# Altium schematic sheet INTERFACE.SchDoc
size 320 x 228 mm; DocumentNumber: 3; SheetNumber: 3; SheetTotal: 5
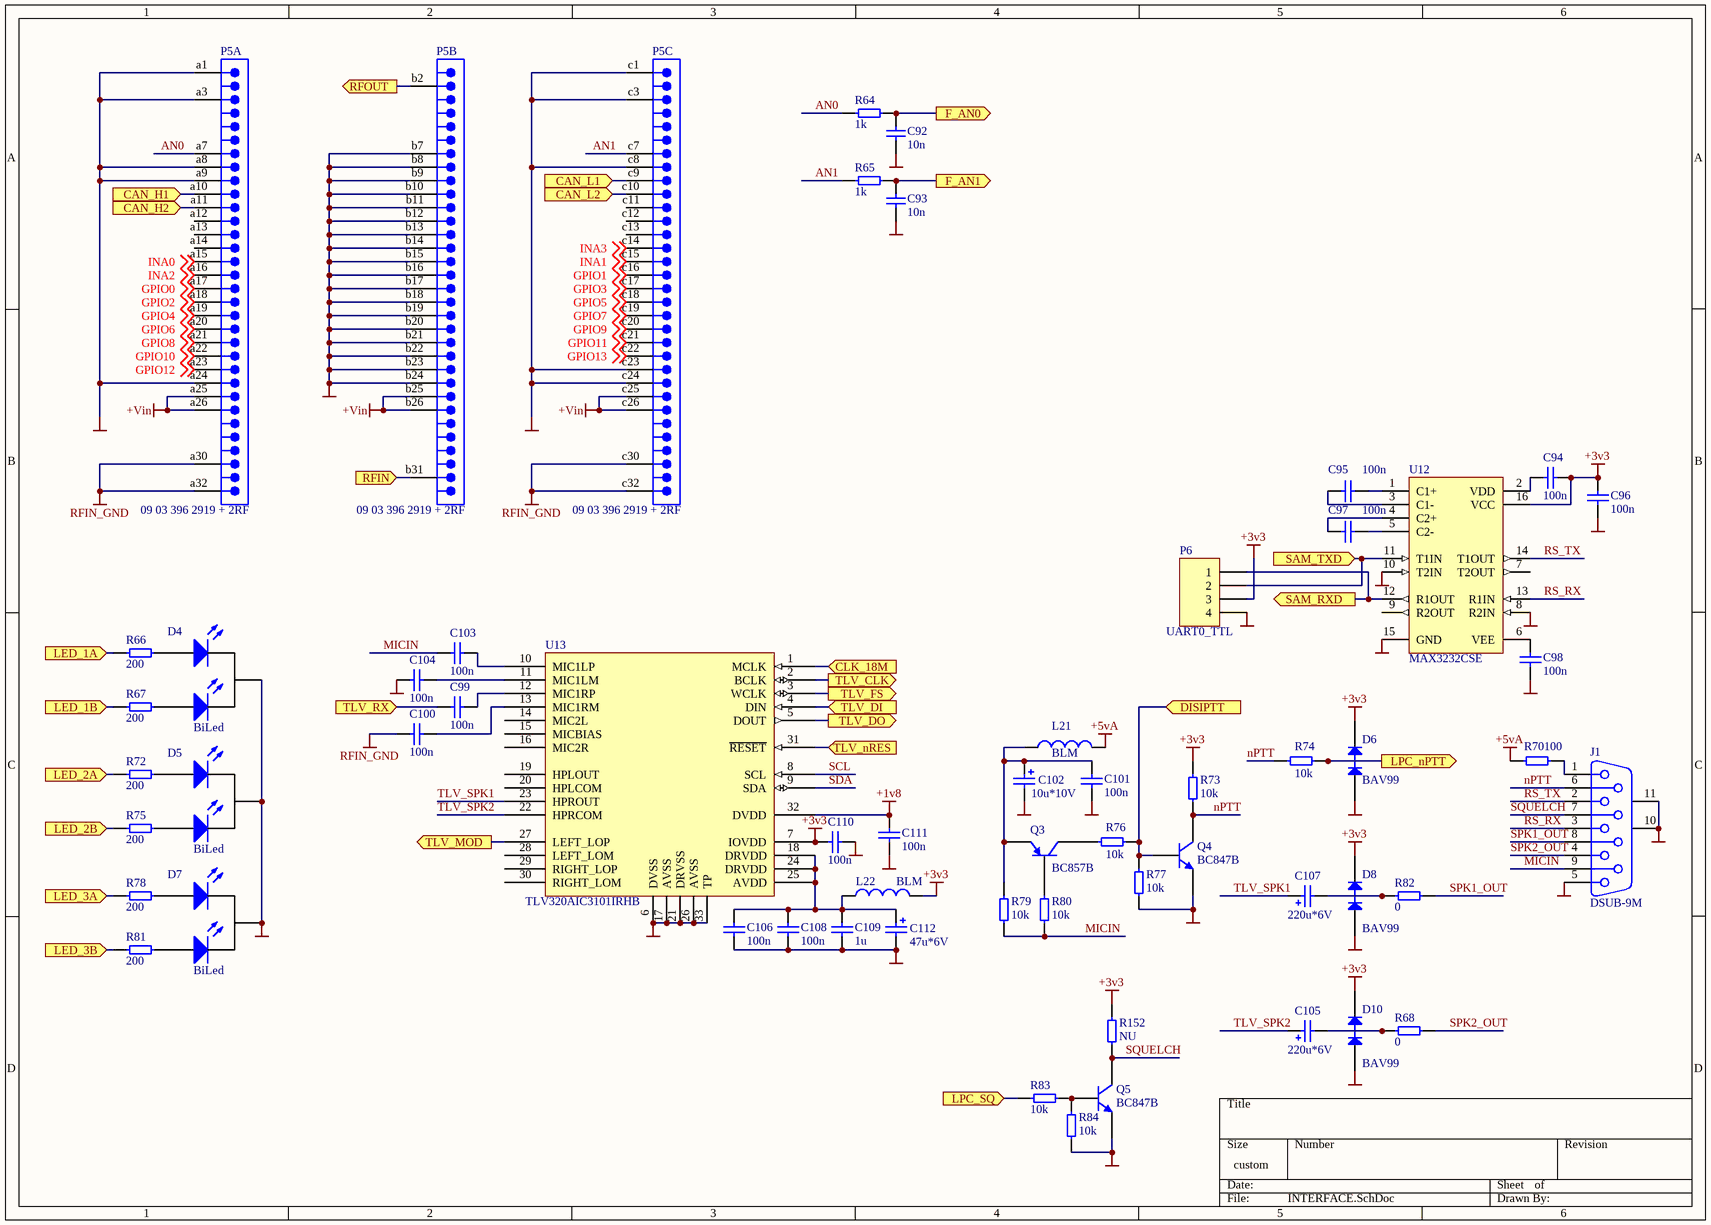
[diagram p0: INTERFACE.SchDoc]

## Parts
C92  10n  [CAPC1608L]
C93  10n  [CAPC1608L]
C94  100n  [CAPC1608N]
C95  100n  [CAPC1608N]
C96  100n  [CAPC1608N]
C97  100n  [CAPC1608N]
C98  100n  [CAPC1608N]
C99  100n  [CAPC1608N]
C100  100n  [CAPC1608N]
C101  100n  [CAPC1608N]
C102  10u*10V  [Case_A]
C103  100n  [CAPC1608N]
C104  100n  [CAPC1608N]
C105  220u*6V  [Case_C]
C106  100n  [CAPC1608N]
C107  220u*6V  [Case_C]
C108  100n  [CAPC1608N]
C109  1u  [CAPC2012N]
C110  100n  [CAPC1608N]
C111  100n  [CAPC1608N]
C112  47u*6V  [Case_A]
D4  BiLed  [BLED-1]
D5  BiLed  [BLED-1]
D6  BAV99  [SOT-23]
D7  BiLed  [BLED-1]
D8  BAV99  [SOT-23]
D10  BAV99  [SOT-23]
J1  DSUB-9M  [DSUB1.385-2H9]
L21  BLM  [INDC2012L]
L22  BLM  [INDC2012L]
P5  09 03 396 2919 + 2RF  [0903396x919]  (parts A,B,C of 4)
P6  UART0_TTL  [HDR1X4]
Q3  BC857B  [SOT23_N]
Q4  BC847B  [SOT23_N]
Q5  BC847B  [SOT23_N]
R64  1k  [RESC1608L]
R65  1k  [RESC1608L]
R66  200  [RESC1608L]
R67  200  [RESC1608L]
R68  0  [RESC2012L]
R70  100  [RESC2012L]
R72  200  [RESC1608L]
R73  10k  [RESC1608L]
R74  10k  [RESC1608L]
R75  200  [RESC1608L]
R76  10k  [RESC1608L]
R77  10k  [RESC1608L]
R78  200  [RESC1608L]
R79  10k  [RESC1608L]
R80  10k  [RESC1608L]
R81  200  [RESC1608L]
R82  0  [RESC2012L]
R83  10k  [RESC1608L]
R84  10k  [RESC1608L]
R152  NU  [RESC1608L]
U12  MAX3232CSE  [NSO16_N]
U13  TLV320AIC3101IRHB  [QFN50P500X500-32W6N]

## Ports
CAN_H1 (in), CAN_H2 (in), CAN_L1 (in), CAN_L2 (in), CLK_18M (in), DISIPTT (in), F_AN0 (out), F_AN1 (out), LED_1A (in), LED_1B (in), LED_2A (in), LED_2B (in), LED_3A (in), LED_3B (in), LPC_nPTT (out), LPC_SQ (in), RFIN (in), RFOUT (out), SAM_RXD (out), SAM_TXD (in), TLV_CLK (out), TLV_DI (in), TLV_DO (out), TLV_FS (out), TLV_MOD (out), TLV_nRES (in), TLV_RX (in)

## Nets
+1v8: C111.2 U13.32(DVDD)
+3v3: C94.1 C96.2 C110.2 D6.2(K) D8.2(K) D10.2(K) L22.1 P6.3 R73.2 R152.2 U12.16(VCC) U13.7(IOVDD)
+5vA: L21.2 R70.1
+Vin: P5.a25 P5.a26 P5.b25 P5.b26 P5.c25 P5.c26
GND: C92.1 C93.1 C96.1 C98.1 C101.2 C102.2 C104.2 C106.1 C108.1 C109.1 C110.1 C111.1 C112.2 D4.2 D5.2 D6.1(A) D7.2 D8.1(A) D10.1(A) J1.5 J1.10(MH1) J1.11(MH2) P5.a1 P5.a3 P5.a8 P5.a9 P5.a24 P5.b7 P5.b8 P5.b9 P5.b10 P5.b11 P5.b12 P5.b13 P5.b14 P5.b15 P5.b16 P5.b17 P5.b18 P5.b19 P5.b20 P5.b21 P5.b22 P5.b23 P5.b24 P5.c1 P5.c3 P5.c8 P5.c23 P5.c24 P6.4 Q4.2(E) Q5.2(E) R77.1 R84.2 U12.8(R2IN) U12.10(T2IN) U12.15(GND) U13.6(DVSS) U13.17(AVSS) U13.21(DRVSS) U13.26(AVSS) U13.33(TP)
RFIN_GND: C100.2 P5.a30 P5.a32 P5.c30 P5.c32
AN0: P5.a7 R64.1
AN1: P5.c7 R65.1
CAN_H1: P5.a10 ; port CAN_H1
CAN_H2: P5.a11 ; port CAN_H2
CAN_L1: P5.c9 ; port CAN_L1
CAN_L2: P5.c10 ; port CAN_L2
CLK_18M: U13.1(MCLK) ; port CLK_18M
DISIPTT: Q4.1(B) R76.1 R77.2 ; port DISIPTT
F_AN0: C92.2 R64.2 ; port F_AN0
F_AN1: C93.2 R65.2 ; port F_AN1
GPIO0: P5.a17 ; off-sheet GPIO0
GPIO1: P5.c16 ; off-sheet GPIO1
GPIO2: P5.a18 ; off-sheet GPIO2
GPIO3: P5.c17 ; off-sheet GPIO3
GPIO4: P5.a19 ; off-sheet GPIO4
GPIO5: P5.c18 ; off-sheet GPIO5
GPIO6: P5.a20 ; off-sheet GPIO6
GPIO7: P5.c19 ; off-sheet GPIO7
GPIO8: P5.a21 ; off-sheet GPIO8
GPIO9: P5.c20 ; off-sheet GPIO9
GPIO10: P5.a22 ; off-sheet GPIO10
GPIO11: P5.c21 ; off-sheet GPIO11
GPIO12: P5.a23 ; off-sheet GPIO12
GPIO13: P5.c22 ; off-sheet GPIO13
INA0: P5.a15 ; off-sheet INA0
INA1: P5.c15 ; off-sheet INA1
INA2: P5.a16 ; off-sheet INA2
INA3: P5.c14 ; off-sheet INA3
LED_1A: R66.2 ; port LED_1A
LED_1B: R67.2 ; port LED_1B
LED_2A: R72.2 ; port LED_2A
LED_2B: R75.2 ; port LED_2B
LED_3A: R78.2 ; port LED_3A
LED_3B: R81.2 ; port LED_3B
LPC_nPTT: D6.3(C) R74.1 ; port LPC_nPTT
LPC_SQ: R83.1 ; port LPC_SQ
MICIN: C103.1 J1.9 R79.1 R80.1
nPTT: J1.6 Q4.3(C) R73.1 R74.2
RFIN: P5.b31 ; port RFIN
RFOUT: P5.b2 ; port RFOUT
RS_RX: J1.3 U12.13(R1IN)
RS_TX: J1.2 U12.14(T1OUT)
SAM_RXD: P6.1 U12.12(R1OUT) ; port SAM_RXD
SAM_TXD: P6.2 U12.11(T1IN) ; port SAM_TXD
SCL: U13.8(SCL)
SDA: U13.9(SDA)
SPK1_OUT: J1.8 R82.2
SPK2_OUT: J1.4 R68.2
SQUELCH: J1.7 Q5.3(C) R152.1
TLV_CLK: U13.2(BCLK) ; port TLV_CLK
TLV_DI: U13.4(DIN) ; port TLV_DI
TLV_DO: U13.5(DOUT) ; port TLV_DO
TLV_FS: U13.3(WCLK) ; port TLV_FS
TLV_MOD: U13.27(LEFT_LOP) ; port TLV_MOD
TLV_nRES: U13.31(~{RESET}) ; port TLV_nRES
TLV_RX: C99.1 ; port TLV_RX
TLV_SPK1: C107.1 U13.23(HPROUT)
TLV_SPK2: C105.1 U13.22(HPRCOM)
NetC94_2: C94.2 U12.2(VDD)
NetC95_1: C95.1 U12.3(C1-)
NetC95_2: C95.2 U12.1(C1+)
NetC97_1: C97.1 U12.4(C2+)
NetC97_2: C97.2 U12.5(C2-)
NetC98_2: C98.2 U12.6(VEE)
NetC99_2: C99.2 U13.12(MIC1RP)
NetC100_1: C100.1 U13.13(MIC1RM)
NetC101_1: C101.1 C102.1 L21.1 Q3.2(E) R79.2
NetC103_2: C103.2 U13.10(MIC1LP)
NetC104_1: C104.1 U13.11(MIC1LM)
NetC105_2: C105.2 D10.3(C) R68.1
NetC106_2: C106.2 C108.2 C109.2 C112.1 L22.2 U13.18(DRVDD) U13.24(DRVDD) U13.25(AVDD)
NetC107_2: C107.2 D8.3(C) R82.1
NetD4_1: D4.1 R66.1
NetD4_3: D4.3 R67.1
NetD5_1: D5.1 R72.1
NetD5_3: D5.3 R75.1
NetD7_1: D7.1 R78.1
NetD7_3: D7.3 R81.1
NetJ1_1: J1.1 R70.2
NetQ3_1: Q3.1(B) R80.2
NetQ3_3: Q3.3(C) R76.2
NetQ5_1: Q5.1(B) R83.2 R84.1

Not connected (* = marked no-connect by the designer): P5 a12 a13 a14 c11 c12 c13; U12 7(T2OUT) 9(R2OUT); U13 14(MIC2L) 15(MICBIAS) 16(MIC2R) 19(HPLOUT) 20(HPLCOM) 28(LEFT_LOM) 29(RIGHT_LOP) 30(RIGHT_LOM)

## Library data of the parts
C92-C101 C103 C104 C106 C108-C111 = Cap: Capacitor; Value: 100pF; Published: 8-Jun-2000; LatestRevisionDate: 17-Jul-2002; LatestRevisionNote: Re-released for DXP Platform.; PackageReference: RAD-0.3; Publisher: Altium Limited
C102 C105 C107 C112 = Cap Pol: Polarized Capacitor (Surface Mount); Value: 100pF; Published: 8-Jun-2000; LatestRevisionDate: 17-Jul-2002; LatestRevisionNote: Re-released for DXP Platform.; PackageReference: C0805; Publisher: Altium Limited
D6 D8 D10 = BAV99: Silicon Switching Diode Array for High-Speed Switching; Published: 21-Mar-2003; DatasheetDocument: Oct-1999; PackageDocument: Sep-2001; PackageReference: SOT-23; Publisher: Altium Limited; ComponentLink1Description: Manufacturer Link; ComponentLink1URL: http://www.infineon.com/; ComponentLink2Description: Datasheet; ComponentLink2URL: http://www.infineon.com/upload/Document/cmc_upload/documents/080/631/bav99series_1.pdf
J1 = D Connector 9: Receptacle Assembly, 9 Position, Right Angle; PackageDocument: O; Positions: 9; Published: 15-Jun-2001; LatestRevisionDate: 17-Jul-2002; LatestRevisionNote: Re-released for DXP Platform.; DatasheetDocument: 1-Sep-1999; PackageReference: 788750; Publisher: Altium Limited; Orientation: Right Angle; Gender: Receptacle
L21 L22 = INDUCTOR
P5 = 09 03 396 2919: Eurocard DIN 41612, Type C, 96 Position, Rows a+b+c, Performance level 1, Male, Lead 3.0 mm, Pitch 2.54 mm; DrillSize: Corresponds to nominal value.; Published: 6-Oct-2005; DatasheetDocument: 03-Jun-2003; PackageDocument: 25-Jan-2002; PackageReference: 0903396x919; Publisher: Altium Limited; ComponentLink1Description: Manufacturer Link; ComponentLink1URL: http://www.harting.com/; ComponentLink2Description: Packaging Specification; ComponentLink2URL: http://www.harkis.harting.com/_gds/pdf/TB_0903396x919_BL01_R30797.pdf
P6 = Header 4: Header, 4-Pin; LatestRevisionDate: 17-Jul-2002; LatestRevisionNote: Re-released for DXP Platform.; Publisher: Altium Limited
Q3 = BC857B: PNP General-purpose Transistor; Published: 17-Sep-2003; LatestRevisionDate: 12-Dec-2006; LatestRevisionNote: IPC-7351 Footprint Added.; DatasheetVersion: 4-Feb-2002; PackageVersion: May-1999; PackageReference: SOT23; Publisher: Altium Limited; PackageDescription: 3-Pin SOT-23 Package 0.95 mm Pitch, 2.3 mm Lead Span; ComponentLink1Description: Manufacturer Link; ComponentLink1URL: http://www.semiconductors.philips.com/; ComponentLink2Description: Datasheet; ComponentLink2URL: http://www.semiconductors.philips.com/acrobat/datasheets/BC856_BC857_BC858_6.pdf
Q4 Q5 = BC847B: NPN General-purpose Transistor; Published: 17-Sep-2003; LatestRevisionDate: 12-Dec-2006; LatestRevisionNote: IPC-7351 Footprint Added.; DatasheetVersion: 4-Feb-2002; PackageVersion: May-1999; PackageReference: SOT23; Publisher: Altium Limited; PackageDescription: 3-Pin SOT-23 Package 0.95 mm Pitch, 2.3 mm Lead Span; ComponentLink1Description: Manufacturer Link; ComponentLink1URL: http://www.semiconductors.philips.com/; ComponentLink2Description: Datasheet; ComponentLink2URL: http://www.semiconductors.philips.com/acrobat/datasheets/BC846_BC847_BC848_5.pdf
R64 R65 = Res: Resistor; Published: 8-Jun-2000; LatestRevisionDate: 04-Mar-2005; LatestRevisionNote: PCB Footprint replaced.; PackageReference: J1-0603; Publisher: Altium Limited; Value: 1K
R66-R68 R70 R72-R84 R152 = Res: Resistor; Value: 1K; Published: 8-Jun-2000; LatestRevisionDate: 04-Mar-2005; LatestRevisionNote: PCB Footprint replaced.; PackageReference: J1-0603; Publisher: Altium Limited
U12 = MAX232CSE: +5V Powered, Multi-Channel RS-232 Driver/Receiver; Published: 16-Jan-2001; LatestRevisionDate: 13-Apr-2006; LatestRevisionNote: IPC-7351 Footprint Added.; PackageReference: NSO16; Publisher: Altium Limited; PackageDescription: 16-Pin Small Outline Integrated Circuit 1.27 mm Pitch; Code_JEDEC: MS-012-AC; Code_IPC: SOIC127P600-16; ComponentLink1Description: Manufacturer Link; ComponentLink1URL: http://www.maxim-ic.com/; ComponentLink2Description: Datasheet; ComponentLink2URL: http://pdfserv.maxim-ic.com/en/ds/MAX220-MAX249.pdf
U13 = TLV320AIC3101IRHB: Low-power stereo codec